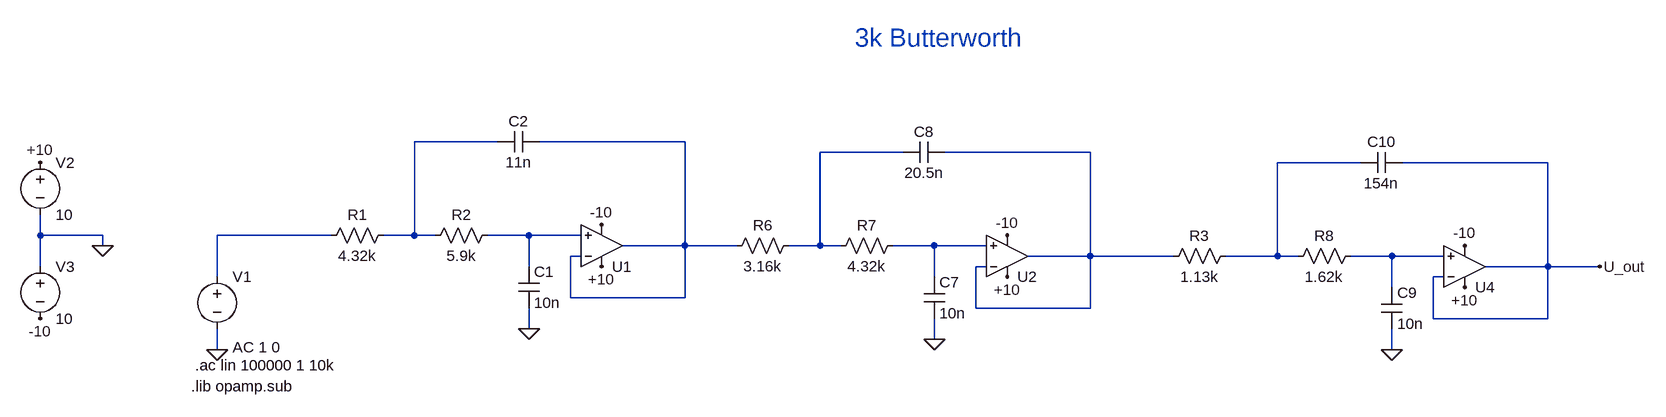
[diagram p0: schematic 6thOrderButterworth.asc]
6thOrderButterworth.asc, the LTspice schematic file:
Version 4
SHEET 1 2216 1156
WIRE 432 256 304 256
WIRE 720 256 496 256
WIRE 1056 272 928 272
WIRE 1344 272 1120 272
WIRE 1760 288 1632 288
WIRE 2048 288 1824 288
WIRE -272 400 -272 368
WIRE -176 400 -272 400
WIRE 176 400 0 400
WIRE 304 400 304 256
WIRE 304 400 256 400
WIRE 336 400 304 400
WIRE 480 400 416 400
WIRE 560 400 480 400
WIRE -176 416 -176 400
WIRE 720 416 720 256
WIRE 720 416 624 416
WIRE 800 416 720 416
WIRE 928 416 928 272
WIRE 928 416 880 416
WIRE 960 416 928 416
WIRE 1104 416 1040 416
WIRE 1184 416 1104 416
WIRE 560 432 544 432
WIRE 1344 432 1344 272
WIRE 1344 432 1248 432
WIRE 1472 432 1344 432
WIRE 1632 432 1632 288
WIRE 1632 432 1552 432
WIRE 1664 432 1632 432
WIRE 1808 432 1744 432
WIRE 1888 432 1808 432
WIRE -272 448 -272 400
WIRE 480 448 480 400
WIRE 1184 448 1168 448
WIRE 2048 448 2048 288
WIRE 2048 448 1952 448
WIRE 2128 448 2048 448
WIRE 0 464 0 400
WIRE 1104 464 1104 416
WIRE 1888 464 1872 464
WIRE 1808 480 1808 432
WIRE 544 496 544 432
WIRE 720 496 720 416
WIRE 720 496 544 496
WIRE 1168 512 1168 448
WIRE 1344 512 1344 432
WIRE 1344 512 1168 512
WIRE 1872 528 1872 464
WIRE 2048 528 2048 448
WIRE 2048 528 1872 528
WIRE 480 544 480 512
WIRE 1104 560 1104 528
WIRE 0 576 0 544
WIRE 1808 576 1808 544
FLAG 480 544 0
FLAG 0 576 0
FLAG 1104 560 0
FLAG 1808 576 0
FLAG 2128 448 U_out
FLAG -176 416 0
FLAG -272 288 +10
FLAG -272 528 -10
FLAG 592 448 +10
FLAG 592 384 -10
FLAG 1216 464 +10
FLAG 1216 400 -10
FLAG 1920 480 +10
FLAG 1920 416 -10
SYMBOL voltage 0 448 R0
WINDOW 3 24 152 Left 2
WINDOW 123 24 124 Left 2
WINDOW 39 0 0 Left 0
SYMATTR InstName V1
SYMATTR Value ""
SYMATTR Value2 AC 1 0
SYMBOL res 272 384 R90
WINDOW 0 0 56 VBottom 2
WINDOW 3 32 56 VTop 2
SYMATTR InstName R1
SYMATTR Value 4.32k
SYMBOL cap 464 448 R0
SYMATTR InstName C1
SYMATTR Value 10n
SYMBOL res 432 384 R90
WINDOW 0 0 56 VBottom 2
WINDOW 3 32 56 VTop 2
SYMATTR InstName R2
SYMATTR Value 5.9k
SYMBOL cap 496 240 R90
WINDOW 0 0 32 VBottom 2
WINDOW 3 32 32 VTop 2
SYMATTR InstName C2
SYMATTR Value 11n
SYMBOL res 896 400 R90
WINDOW 0 0 56 VBottom 2
WINDOW 3 32 56 VTop 2
SYMATTR InstName R6
SYMATTR Value 3.16k
SYMBOL cap 1088 464 R0
SYMATTR InstName C7
SYMATTR Value 10n
SYMBOL res 1056 400 R90
WINDOW 0 0 56 VBottom 2
WINDOW 3 32 56 VTop 2
SYMATTR InstName R7
SYMATTR Value 4.32k
SYMBOL cap 1120 256 R90
WINDOW 0 0 32 VBottom 2
WINDOW 3 32 32 VTop 2
SYMATTR InstName C8
SYMATTR Value 20.5n
SYMBOL cap 1792 480 R0
SYMATTR InstName C9
SYMATTR Value 10n
SYMBOL res 1760 416 R90
WINDOW 0 0 56 VBottom 2
WINDOW 3 32 56 VTop 2
SYMATTR InstName R8
SYMATTR Value 1.62k
SYMBOL cap 1824 272 R90
WINDOW 0 0 32 VBottom 2
WINDOW 3 32 32 VTop 2
SYMATTR InstName C10
SYMATTR Value 154n
SYMBOL res 1568 416 R90
WINDOW 0 0 56 VBottom 2
WINDOW 3 32 56 VTop 2
SYMATTR InstName R3
SYMATTR Value 1.13k
SYMBOL voltage -272 272 R0
WINDOW 123 0 0 Left 0
WINDOW 39 0 0 Left 0
SYMATTR InstName V2
SYMATTR Value 10
SYMBOL voltage -272 432 R0
WINDOW 123 0 0 Left 0
WINDOW 39 0 0 Left 0
SYMATTR InstName V3
SYMATTR Value 10
SYMBOL OpAmps\\UniversalOpamp2 592 416 M180
SYMATTR InstName U1
SYMBOL OpAmps\\UniversalOpamp2 1216 432 M180
SYMATTR InstName U2
SYMBOL OpAmps\\UniversalOpamp2 1920 448 M180
SYMATTR InstName U4
TEXT -34 600 Left 2 !.ac lin 100000 1 10k
TEXT -40 632 Left 2 !.lib opamp.sub
TEXT 1112 96 Center 4 ;3k Butterworth

The netlist it stands for:
* 6thOrderButterworth.asc
V1 N006 0 AC 1 0
R1 N001 N006 4.32k
C1 N007 0 10n
R2 N007 N001 5.9k
C2 N002 N001 11n
R6 N003 N002 3.16k
C7 N008 0 10n
R7 N008 N003 4.32k
C8 N004 N003 20.5n
C9 N009 0 10n
R8 N009 N005 1.62k
C10 U_out N005 154n
R3 N005 N004 1.13k
V2 +10 0 10
V3 0 -10 10
XU1 N007 N002 +10 -10 N002 level.2 Avol=1Meg GBW=10Meg Slew=10Meg ilimit=25m rail=0 Vos=0 phimargin=45 en=0 enk=0 in=0 ink=0 Rin=500Meg  ; pins IN+ IN- V+ V- OUT
XU2 N008 N004 +10 -10 N004 level.2 Avol=1Meg GBW=10Meg Slew=10Meg ilimit=25m rail=0 Vos=0 phimargin=45 en=0 enk=0 in=0 ink=0 Rin=500Meg  ; pins IN+ IN- V+ V- OUT
XU4 N009 U_out +10 -10 U_out level.2 Avol=1Meg GBW=10Meg Slew=10Meg ilimit=25m rail=0 Vos=0 phimargin=45 en=0 enk=0 in=0 ink=0 Rin=500Meg  ; pins IN+ IN- V+ V- OUT
.ac lin 100000 1 10k
.lib opamp.sub
* 3k Butterworth
.lib UniversalOpamps2.sub
.backanno
.end

* Results of the author's LTspice run, read from the files saved beside the schematic
* Operating Point, zero values left out:
*   V(+10) = 10 V
*   V(-10) = -10 V
*   I(V3) = -2.999 mA
*   I(V2) = -2.999 mA
*   Ix(u1:3) = 999.5 µA
*   Ix(u1:4) = -999.5 µA
*   Ix(u2:3) = 999.5 µA
*   Ix(u2:4) = -999.5 µA
*   Ix(u4:3) = 999.5 µA
*   Ix(u4:4) = -999.5 µA